# EAGLE design main (EAGLE 9.0.1)

## Sheet 1 of 2
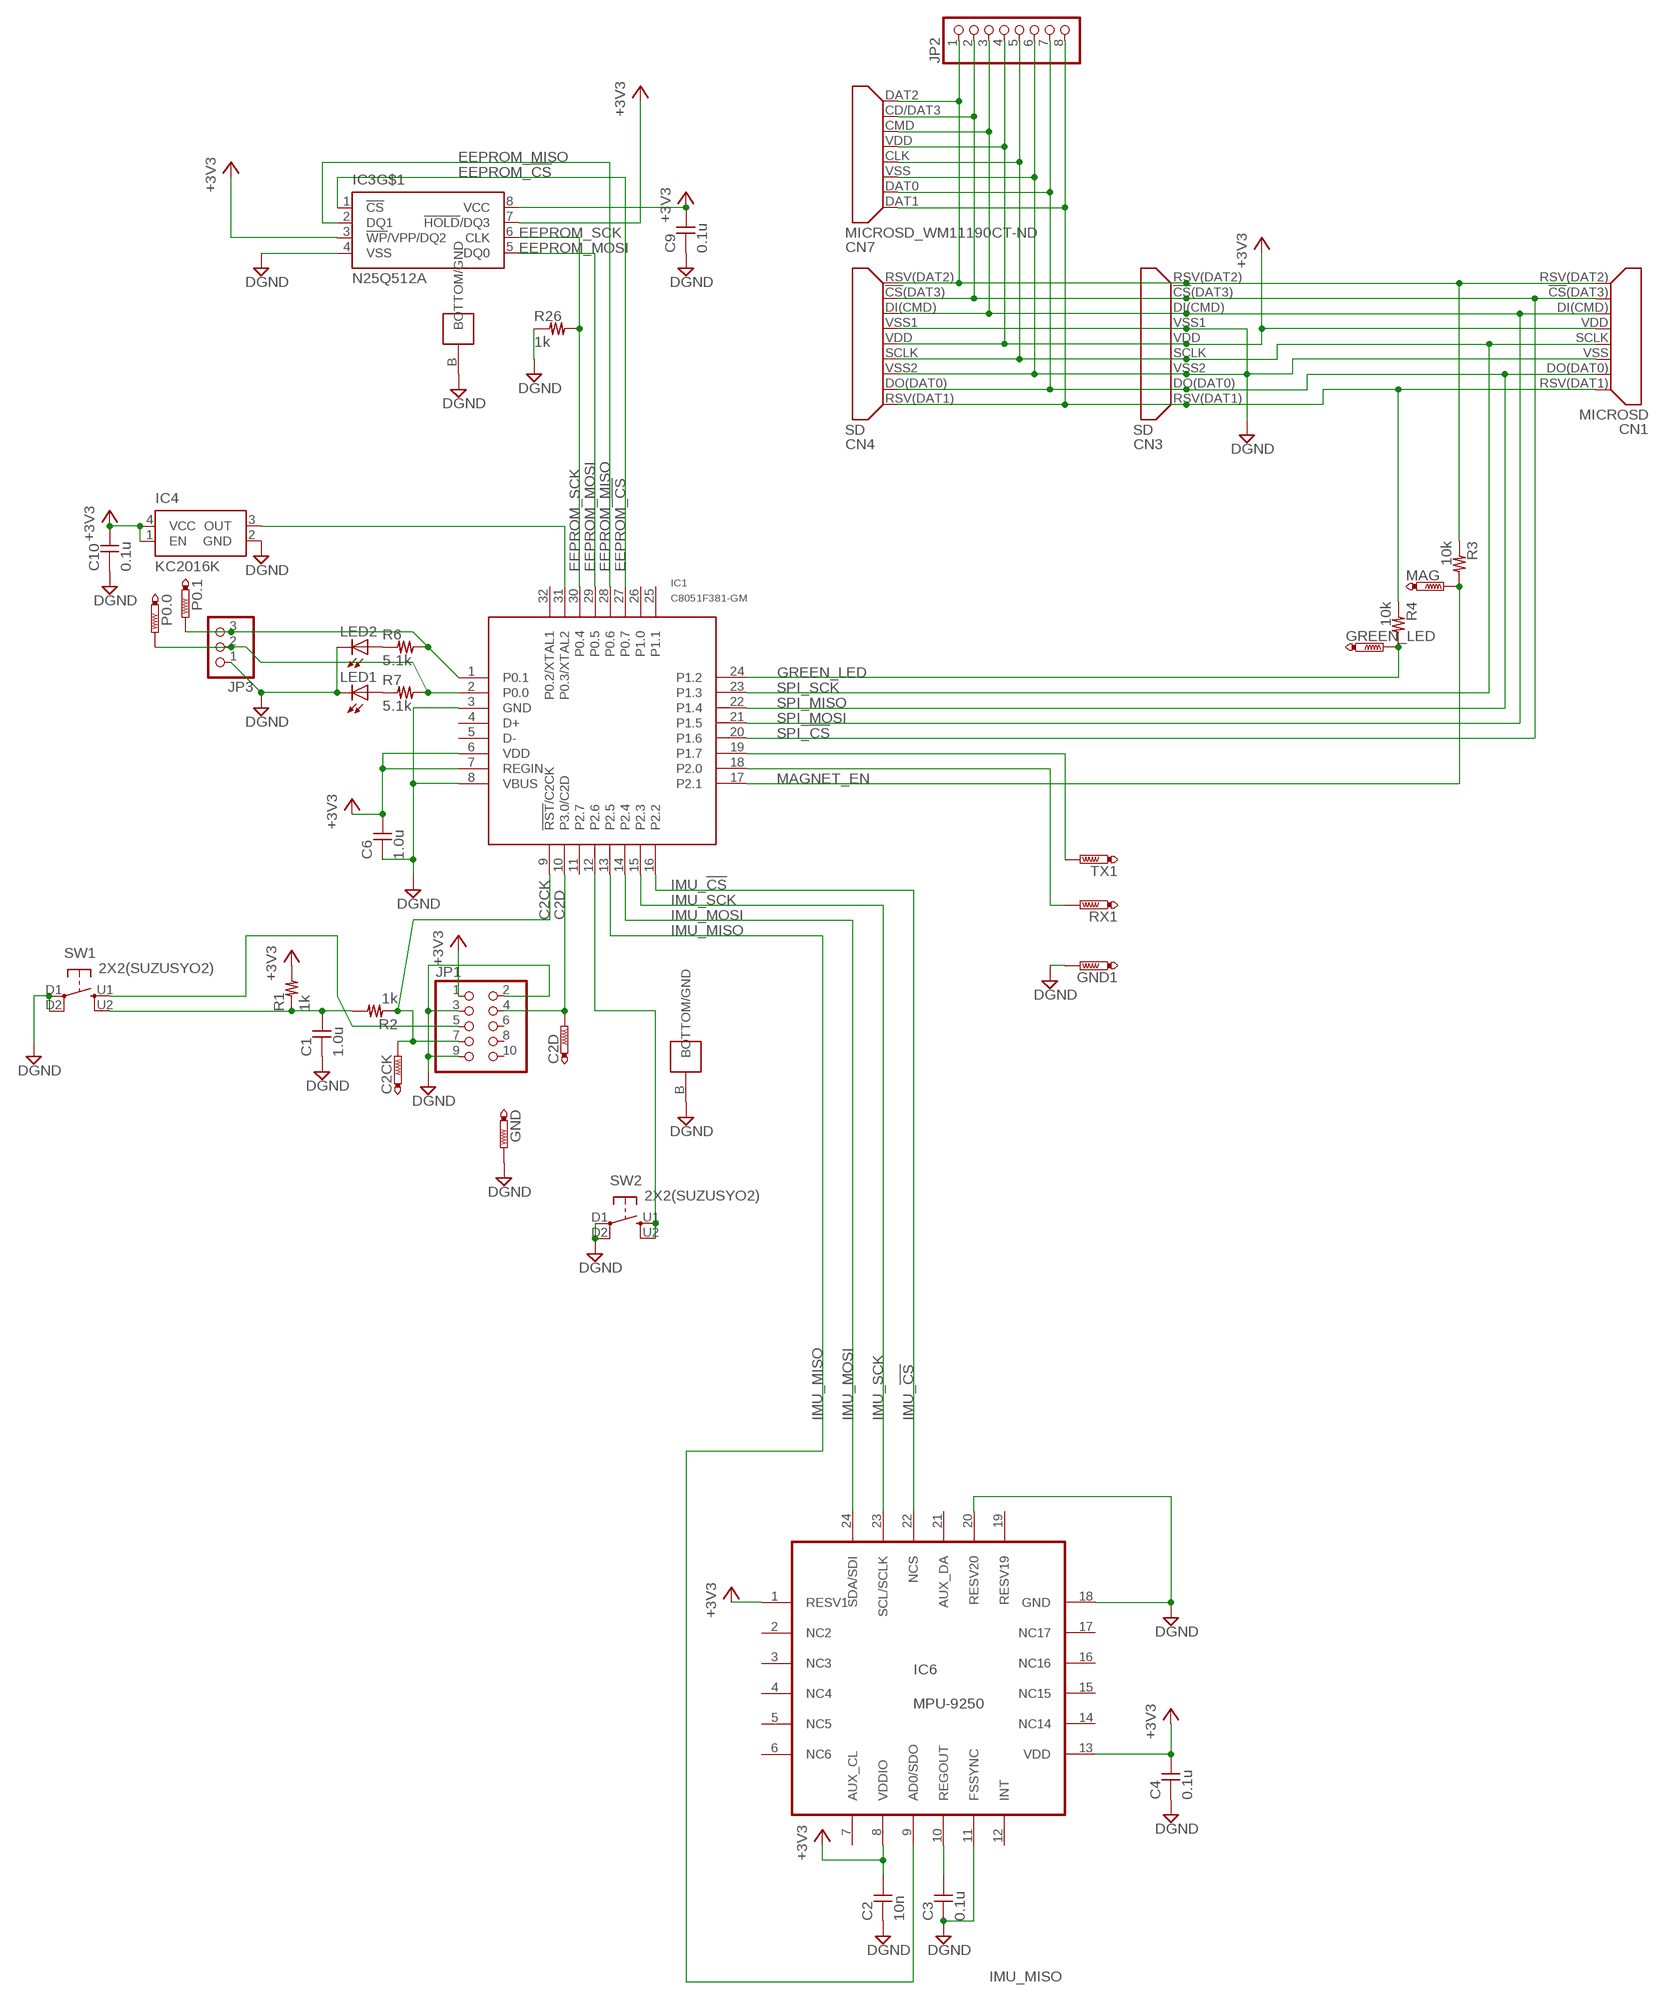
[diagram p0: schematic, sheet 1]

### Parts
C1  1.0u  C-1005  [1005]
C2  10n  C-1005  [1005]
C2CK  PTR1TP10R  [TP10R]
C2D  PTR1TP10R  [TP10R]
C3  0.1u  C-1005  [1005]
C4  0.1u  C-1005  [1005]
C6  1.0u  C-1005  [1005]
C9  0.1u  C-1005  [1005]
C10  0.1u  C-1005  [1005]
CN1  MICROSD  [MICROSD]
CN3  SD  [SD]
CN4  SD  [SD]
CN7  MICROSD_WM11190CT-ND  [5033981892]
GND  PTR1TP10R  [TP10R]
GND1  PTR1TP10R  [TP10R]
GREEN_LED  PTR1TP10R  [TP10R]
IC1  C8051F381-GM  [QFN32]
IC3  N25Q512A  [V-PDFN-8]
IC4  KC2016K  [KC2016K]
IC6  MPU-9250  [QFN-24]
JP1  PINHD-2X5  [2X05]
JP2  PINHD-1X8  [1X08]
JP3  PINHD-1X3  [1X03]
LED1  LED1608O  [1608-OLI]
LED2  LED1608O  [1608-OLI]
MAG  PTR1TP10R  [TP10R]
P0.0  PTR1TP10R  [TP10R]
P0.1  PTR1TP10R  [TP10R]
R1  1k  R-1005  [1005]
R2  1k  R-1005  [1005]
R3  10k  R-1005  [1005]
R4  10k  R-1005  [1005]
R6  5.1k  R-1005  [1005]
R7  5.1k  R-1005  [1005]
R26  1k  R-1005  [1005]
RX1  PTR1TP10R  [TP10R]
SW1  2X2(SUZUSYO2)  [2X2(SUZUSYO2)]
SW2  2X2(SUZUSYO2)  [2X2(SUZUSYO2)]
TX1  PTR1TP10R  [TP10R]

### Nets
+3V3: C2.P$2 C4.P$2 C6.P$2 C9.P$2 C10.P$2 CN1.VDD CN3.VDD CN4.VDD CN7.VDD IC1.6(VDD) IC1.7(REGIN) IC3.3(!WP!/VPP/DQ2) IC3.7(!HOLD!/DQ3) IC3.8(VCC) IC4.1(EN) IC4.4(VCC) IC6.1(RESV1) IC6.8(VDDIO) IC6.13(VDD) JP1.1 JP2.4 R1.P$2
C2CK: C2CK.TP IC1.9(!RST!/C2CK) JP1.7 R2.P$1
C2D: C2D.TP IC1.10(P3.0/C2D) JP1.4
DGND: C1.P$1 C2.P$1 C3.P$1 C4.P$1 C6.P$1 C9.P$1 C10.P$1 CN1.VSS CN3.VSS1 CN3.VSS2 CN4.VSS1 CN4.VSS2 CN7.VSS GND1.TP GND.TP IC1.3(GND) IC1.8(VBUS) IC1.B(BOTTOM/GND) IC3.4(VSS) IC3.B(BOTTOM/GND) IC4.2(GND) IC6.11(FSSYNC) IC6.18(GND) IC6.20(RESV20) JP1.2 JP1.3 JP1.9 JP2.6 JP3.1 LED1.K LED2.K R26.P$1 SW1.D1(P) SW1.D2(P1) SW2.D1(P) SW2.D2(P1) ; also sheet 2
EEPROM_!CS: IC1.27(P0.7) IC3.1(!CS)
EEPROM_MISO: IC1.28(P0.6) IC3.2(DQ1)
EEPROM_MOSI: IC1.29(P0.5) IC3.5(DQ0)
EEPROM_SCK: IC1.30(P0.4) IC3.6(CLK) R26.P$2
GREEN_LED: CN1.RSV(DAT1) CN3.RSV(DAT1) CN4.RSV(DAT1) CN7.DAT1 JP2.8 R4.P$1
IMU_!CS: IC1.16(P2.2) IC6.22(NCS)
IMU_MISO: IC1.13(P2.5) IC6.9(AD0/SDO)
IMU_MOSI: IC1.14(P2.4) IC6.24(SDA/SDI)
IMU_SCK: IC1.15(P2.3) IC6.23(SCL/SCLK)
MAGNET_EN: CN1.RSV(DAT2) CN3.RSV(DAT2) CN4.RSV(DAT2) CN7.DAT2 JP2.1 R3.P$1
N$1: IC1.19(P1.7) TX1.TP
N$2: IC1.18(P2.0) RX1.TP
N$3: JP1.5 SW1.U1(S)
N$4: IC1.1(P0.1) JP3.3 P0.1.TP R6.P$2
N$6: LED2.A R6.P$1
N$7: GREEN_LED.TP IC1.24(P1.2) R4.P$2
N$9: LED1.A R7.P$1
N$11: IC1.31(P0.3/XTAL2) IC4.3(OUT)
N$12: IC1.12(P2.6) SW2.U1(S) SW2.U2(S1)
N$13: C3.P$2 IC6.10(REGOUT)
N$14: IC1.17(P2.1) MAG.TP R3.P$2
N$15: IC1.2(P0.0) JP3.2 P0.0.TP R7.P$2
N$27: C1.P$2 R1.P$1 R2.P$2 SW1.U2(S1)
SPI_!CS: CN1.!CS!(DAT3) CN3.!CS!(DAT3) CN4.!CS!(DAT3) CN7.CD/DAT3 IC1.20(P1.6) JP2.2
SPI_MISO: CN1.DO(DAT0) CN3.DO(DAT0) CN4.DO(DAT0) CN7.DAT0 IC1.22(P1.4) JP2.7
SPI_MOSI: CN1.DI(CMD) CN3.DI(CMD) CN4.DI(CMD) CN7.CMD IC1.21(P1.5) JP2.3
SPI_SCK: CN1.SCLK CN3.SCLK CN4.SCLK CN7.CLK IC1.23(P1.3) JP2.5
Unconnected: IC1.4(D+) IC1.5(D-) IC1.11(P2.7) IC1.25(P1.1) IC1.26(P1.0) IC1.32(P0.2/XTAL1) IC6.2(NC2) IC6.3(NC3) IC6.4(NC4) IC6.5(NC5) IC6.6(NC6) IC6.7(AUX_CL) IC6.12(INT) IC6.14(NC14) IC6.15(NC15) IC6.16(NC16) IC6.17(NC17) IC6.19(RESV19) IC6.21(AUX_DA) JP1.6 JP1.8 JP1.10

## Sheet 2 of 2
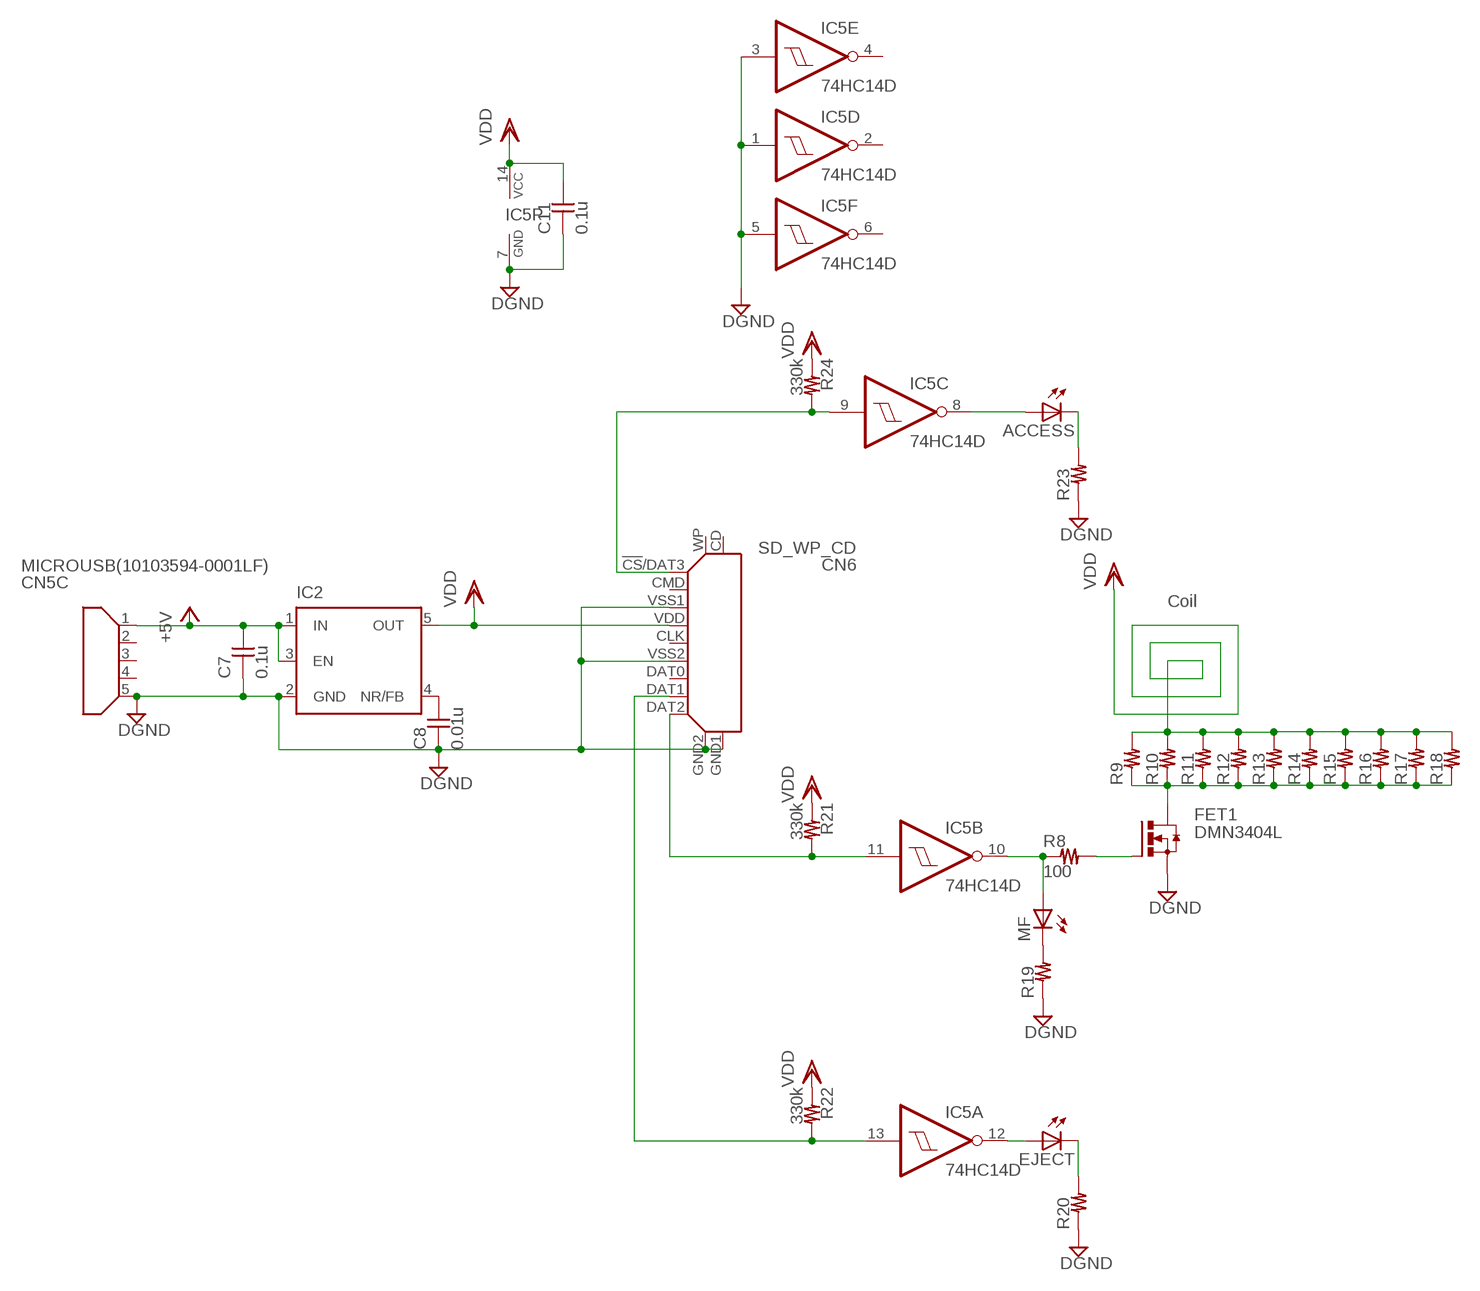
[diagram p1: schematic, sheet 2]

### Parts
ACCESS  LED2012  [2012]
C7  0.1u  C-1005  [1005]
C8  0.01u  C-1005  [1005]
C11  0.1u  C-1005  [1005]
CN5  MICROUSB(10103594-0001LF)  [MICROUSB(10103594-0001LF)]
CN6  SD_WP_CD  [10067847-001RLF]
EJECT  LED2012  [2012]
FET1  DMN3404L  [SOT23]
IC2  REGURATOR_SOT23  [SOT23]
IC5  74HC14D  [SO14]
MF  LED2012  [2012]
R8  100  R-1005  [1005]
R9  R-2012  [2012]
R10  R-2012  [2012]
R11  R-2012  [2012]
R12  R-2012  [2012]
R13  R-2012  [2012]
R14  R-2012  [2012]
R15  R-2012  [2012]
R16  R-2012  [2012]
R17  R-2012  [2012]
R18  R-2012  [2012]
R19  R-1005  [1005]
R20  R-1005  [1005]
R21  330k  R-1005  [1005]
R22  330k  R-1005  [1005]
R23  R-1005  [1005]
R24  330k  R-1005  [1005]

### Nets
+5V: C7.P$2 CN5.1 IC2.1(IN) IC2.3(EN)
DGND: C7.P$1 C8.P$1 C11.P$1 CN5.5 CN6.GND1 CN6.GND2 CN6.VSS1 CN6.VSS2 FET1.S IC2.2(GND) IC5.1(D:I) IC5.3(E:I) IC5.5(F:I) IC5.7(P:GND) R19.P$1 R20.P$1 R23.P$1 ; also sheet 1
N$8: EJECT.P$2(K) R20.P$2
N$10: C8.P$2 IC2.4(NR/FB)
N$17: IC5.10(B:O) MF.P$1(A) R8.P$1
N$18: CN6.DAT2 IC5.11(B:I) R21.P$2
N$19: EJECT.P$1(A) IC5.12(A:O)
N$20: CN6.DAT1 IC5.13(A:I) R22.P$2
N$21: FET1.G R8.P$2
N$22: FET1.D R9.P$1 R10.P$1 R11.P$1 R12.P$1 R13.P$1 R14.P$1 R15.P$1 R16.P$1 R17.P$1 R18.P$1
N$23: ACCESS.P$2(K) R23.P$2
N$24: MF.P$2(K) R19.P$2
N$25: ACCESS.P$1(A) IC5.8(C:O)
N$26: CN6.!CS!/DAT3 IC5.9(C:I) R24.P$2
VDD: C11.P$2 CN6.VDD IC2.5(OUT) IC5.14(P:VCC) R9.P$2 R10.P$2 R11.P$2 R12.P$2 R13.P$2 R14.P$2 R15.P$2 R16.P$2 R17.P$2 R18.P$2 R21.P$1 R22.P$1 R24.P$1
Unconnected: CN5.2 CN5.3 CN5.4 CN5.S1 CN5.S2 CN5.S3 CN5.S4 CN6.CD CN6.CLK CN6.CMD CN6.DAT0 CN6.WP IC5.2(D:O) IC5.4(E:O) IC5.6(F:O)

### Notes on the sheet
- Coil

## Library data of the parts
ACCESS EJECT LED1 LED2 MF = LED:LED
C1-C4 C6-C11 = reg,cap:C-
C2CK C2D GND GND1 GREEN_LED MAG P0.0 P0.1 RX1 TX1 = testpad:PTR1: TEST PIN
CN1 = Connector:MICROSD
CN3 CN4 = Connector:SD
CN5 = Connector:MICROUSB(10103594-0001LF)
CN6 = Connector:SD_WP_CD
CN7 = Connector:MICROSD_WM11190CT-ND
FET1 = MOSFET:DMN3404L
IC1 = C8051F34x:C8051F381-GM
IC2 = linear:REGURATOR_SOT23
IC3 = EEPROM:N25Q512A
IC4 = Oscillator:KC2016K
IC5 = 74xx:74*14: Hex schmitt trigger INVERTER
IC6 = GYRO:MPU-9250
JP1 = pinhead:PINHD-2X5: PIN HEADER
JP2 = pinhead:PINHD-1X8: PIN HEADER
JP3 = pinhead:PINHD-1X3: PIN HEADER
R1-R4 R6-R24 R26 = reg,cap:R-
SW1 SW2 = Switch:2X2(SUZUSYO2)

## Board
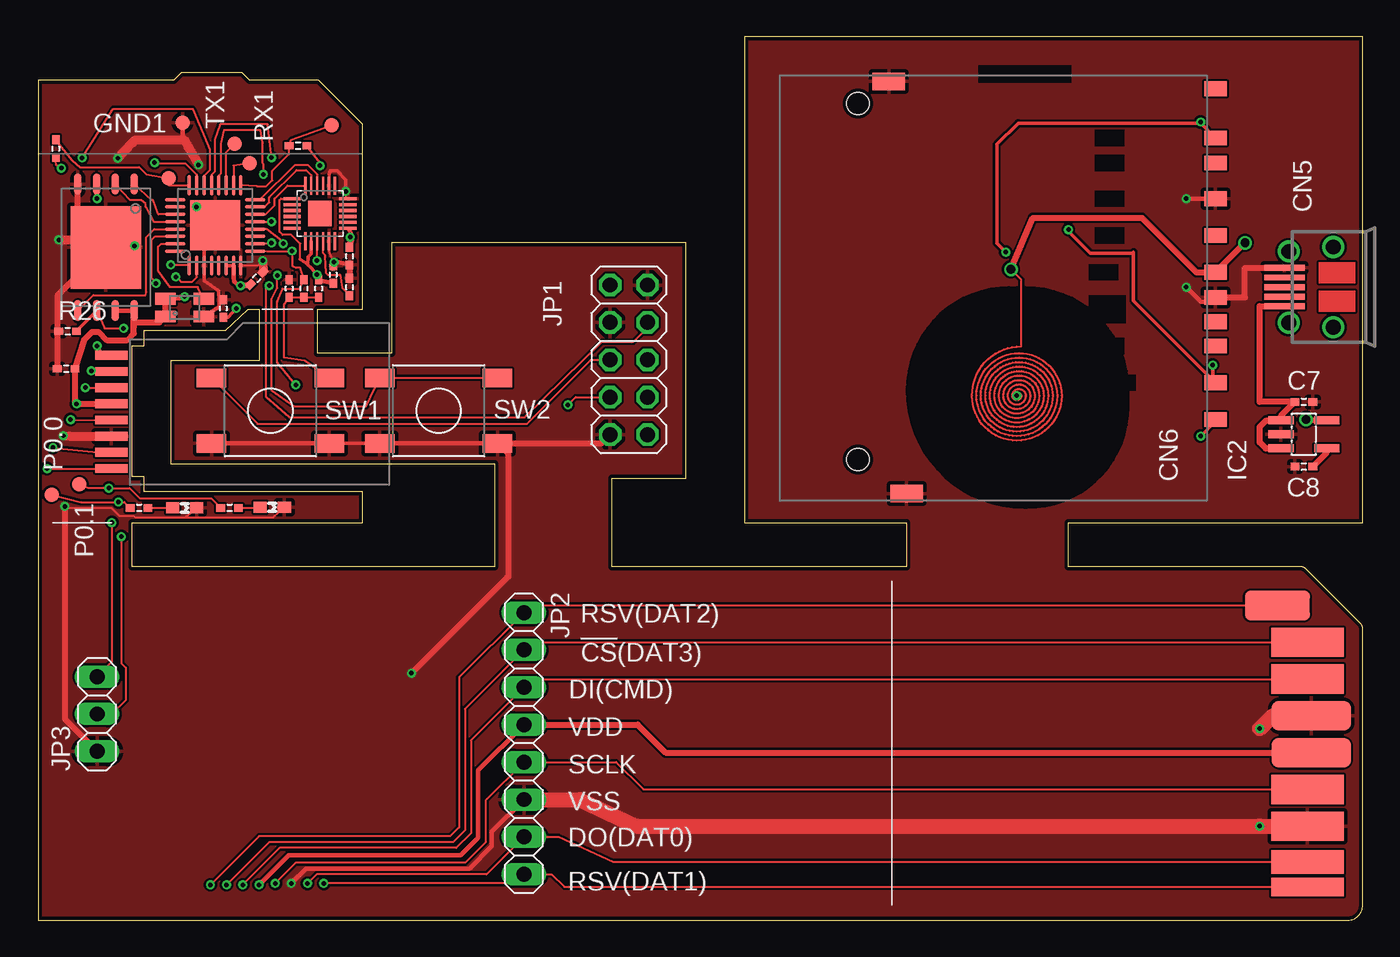
[diagram p2: board, top side]
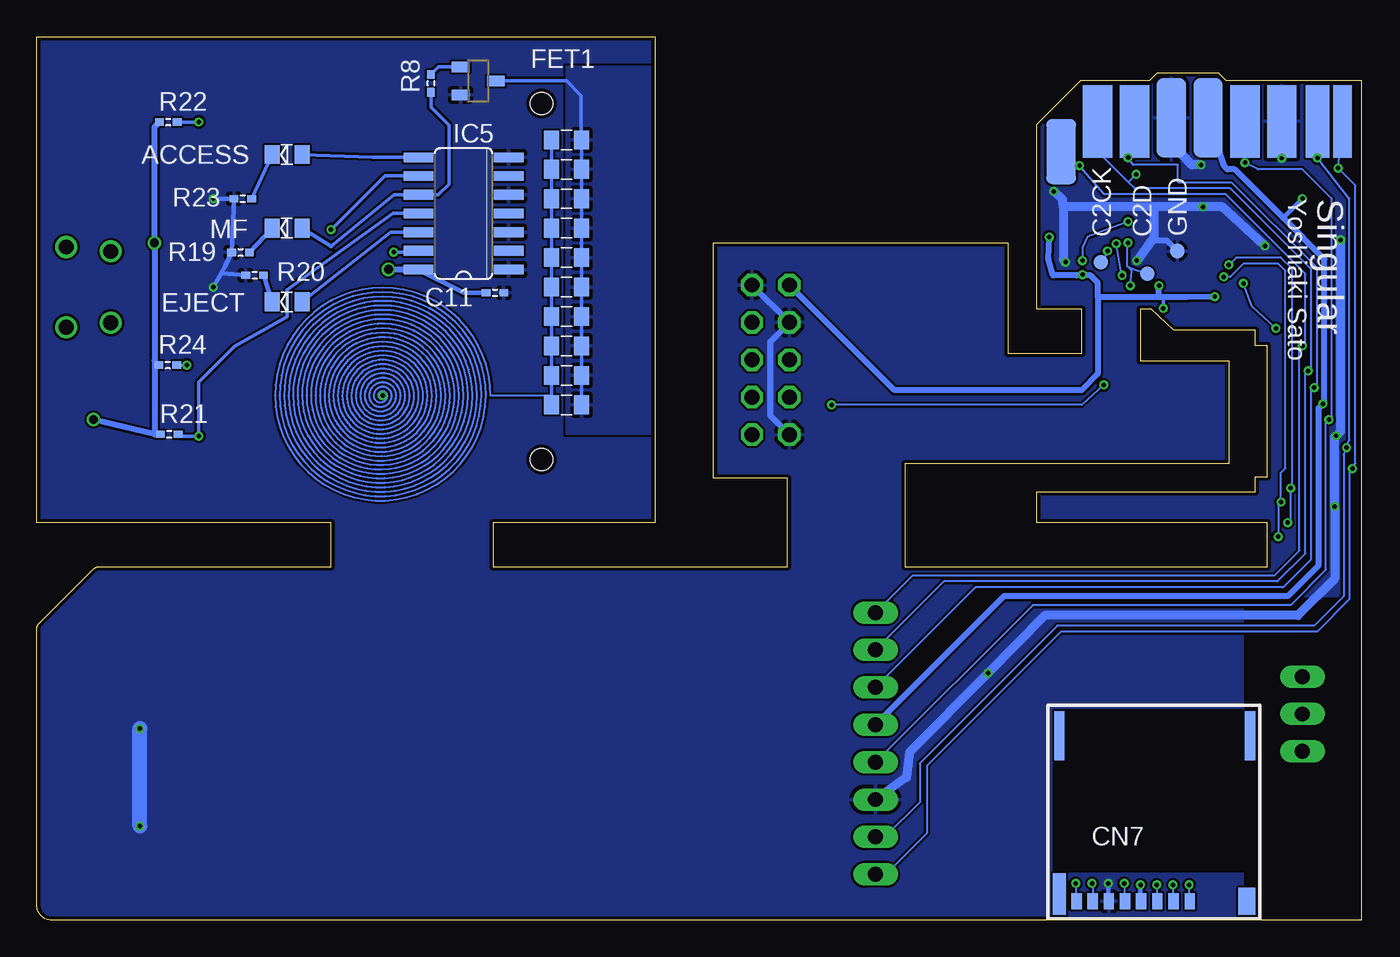
[diagram p3: board, bottom side, seen from below]

Size 90 x 60 mm. Coordinates in mm from the lower left corner, seen from the top.
Outline: 31,24 6.4,24 6.4,27 22.05,27 22.05,29.1 7.2,29.1 7.2,30.1 6.4,30.1 6.4,39 7.2,39 7.2,40.05 12.75,40.05 14.25,41.5 15,41.5 15,38 9,38 9,31 31,31 31,24
Outline: 39,24 39,30 44,30 44,46 24,46 24,38.5 19,38.5 19,41.5 22.05,41.5 22.05,54.05 19.05,57.05 14.35,57.05 13.85,57.55 9.7,57.55 9.2,57.05 0,57.05 0,0 89,0 arc90 90,1 90,19.79 arc45 89.85,20.15 86.15,23.85 arc45 85.79,24 70,24 70,27 90,27 90,60 48,60 48,27 59,27 59,24 39,24
Copper layers (1*16): Top 0.035mm / dielectric 1.5mm / Bottom 0.035mm
Design rules "Elecrow_2-layer_eagle_rule": minimum track width 6mil, minimum drill 12mil, track to track 6mil, track to pad 6mil, pad to pad 6mil, via to via 6mil, smd to smd 0mil, copper to edge 10mil, drill to drill 10mil, minimum pad ring 10mil, minimum via ring 6mil, stop-mask expansion 2mil, vias tented up to drill 100mil, thermal gap 10mil
tRestrict: 9 lines

### Footprints (pad centres in the part's own frame; a part is rotated, then mirrored left to right if it is on the bottom)
2012 = smd 1.02 x 1.27: P$1 -1.02,0; P$2 1.02,0
1005 = smd 0.6 x 0.5: P$1 -0.6,0; P$2 0.6,0
TP10R = smd 1 x 1: TP 0,0
MICROSD = smd 2.2 x 0.6: !CS!(DAT3) -1.27,-1.1; DI(CMD) -1.27,-2.2; DO(DAT0) -1.27,-6.6; RSV(DAT1) -1.27,-7.7; RSV(DAT2) -1.27,0; SCLK -1.27,-4.4; VDD -1.27,-3.3; VSS -1.27,-5.5
SD = smd 2 x 4.9: !CS!(DAT3) 2.5,2; DI(CMD) 5,2; SCLK 12.5,2; VSS2 15,2 | smd 1.6 x 4.9: DO(DAT0) 17.425,2 | smd 1.25 x 4.9: RSV(DAT1) 19.125,2 | smd 2 x 4.4: RSV(DAT2) 0,-0.05 | smd 2 x 5.4: VDD 10,2.25; VSS1 7.5,2.25
MICROUSB(10103594-0001LF) = smd 0.4 x 2.75: 1 -1.3,3.325; 2 -0.65,3.325; 3 0,3.325; 4 0.65,3.325; 5 1.3,3.325 | drill 1: S1 2.725,0; S2 2.425,3.03; S3 -2.425,3.03; S4 -2.725,0
10067847-001RLF = smd 1 x 1.5: !CS!/DAT3 -2.5,0; CD -6.65,0; CLK -12.5,0; CMD -5,0; DAT0 -17.425,0; DAT1 -19.125,0; DAT2 0,0; VDD -10,0; VSS1 -8.3,0; VSS2 -15,0; WP -22.475,0 | smd 1.2 x 2.2: GND1 5.025,-21; GND2 -22.975,-22.2 | hole 1.5: 2.725,-24.3; -21.475,-24.3
5033981892 = smd 0.7 x 1.1: CD/DAT3 5.55,12.93; CLK 8.85,12.93; CMD 6.65,12.93; DAT0 11.05,12.93; DAT1 12.15,12.93; DAT2 4.45,12.93; VDD 7.75,12.93; VSS 9.95,12.93 | smd 1.14 x 1.83: S1 0.57,12.915 | smd 0.7 x 3.33: S2 0.35,1.665; S3 13.31,1.665 | smd 0.86 x 2.8: S4 13.31,12.43
SOT23 = smd 0.711 x 1.2: D 0,1.2; G -0.95,-1.2; S 0.95,-1.2
QFN32 = smd 1.4 x 0.25: 1 -2.725,1.75; 2 -2.725,1.25; 3 -2.725,0.75; 4 -2.725,0.25; 5 -2.725,-0.25; 6 -2.725,-0.75; 7 -2.725,-1.25; 8 -2.725,-1.75; 17 2.725,-1.75; 18 2.725,-1.25; 19 2.725,-0.75; 20 2.725,-0.25; 21 2.725,0.25; 22 2.725,0.75; 23 2.725,1.25; 24 2.725,1.75 | smd 0.25 x 1.4: 9 -1.75,-2.725; 10 -1.25,-2.725; 11 -0.75,-2.725; 12 -0.25,-2.725; 13 0.25,-2.725; 14 0.75,-2.725; 15 1.25,-2.725; 16 1.75,-2.725; 25 1.75,2.725; 26 1.25,2.725; 27 0.75,2.725; 28 0.25,2.725; 29 -0.25,2.725; 30 -0.75,2.725; 31 -1.25,2.725; 32 -1.75,2.725 | smd 3.4 x 3.4: B 0,0
SOT23' = smd 0.55 x 1.7: 1 -0.95,-1.55; 2 0,-1.55; 3 0.95,-1.55; 4 0.95,1.55; 5 -0.95,1.55
V-PDFN-8 = smd 1.4 x 0.5: 1 -4.3,1.905; 2 -4.3,0.635; 3 -4.3,-0.635; 4 -4.3,-1.905; 5 4.3,-1.905; 6 4.3,-0.635; 7 4.3,0.635; 8 4.3,1.905 | smd 5.6 x 4.8: B 0,0
KC2016K = smd 1.4 x 0.8: 1 -1.3,-0.6; 2 1.3,-0.6; 3 1.3,0.6; 4 -1.3,0.6
SO14 = smd 0.66 x 2.032: 1 -3.81,-3.073; 2 -2.54,-3.073; 3 -1.27,-3.073; 4 0,-3.073; 5 1.27,-3.073; 6 2.54,-3.073; 7 3.81,-3.073; 8 3.81,3.073; 9 2.54,3.073; 10 1.27,3.073; 11 0,3.073; 12 -1.27,3.073; 13 -2.54,3.073; 14 -3.81,3.073
QFN-24 = smd 1.22 x 0.2: 1 -1.89,1; 2 -1.89,0.6; 3 -1.89,0.2; 4 -1.89,-0.2; 5 -1.89,-0.6; 6 -1.89,-1; 13 1.89,-1; 14 1.89,-0.6; 15 1.89,-0.2; 16 1.89,0.2; 17 1.89,0.6; 18 1.89,1 | smd 0.2 x 1.22: 7 -1,-1.89; 8 -0.6,-1.89; 9 -0.2,-1.89; 10 0.2,-1.89; 11 0.6,-1.89; 12 1,-1.89; 19 1,1.89; 20 0.6,1.89; 21 0.2,1.89; 22 -0.2,1.89; 23 -0.6,1.89; 24 -1,1.89 | smd 1.59 x 1.75: B 0,0
2X05 = drill 1.016 octagon: 1 -5.08,-1.27; 2 -5.08,1.27; 3 -2.54,-1.27; 4 -2.54,1.27; 5 0,-1.27; 6 0,1.27; 7 2.54,-1.27; 8 2.54,1.27; 9 5.08,-1.27; 10 5.08,1.27
1X08 = drill 1.016 long: 1 -8.89,0; 2 -6.35,0; 3 -3.81,0; 4 -1.27,0; 5 1.27,0; 6 3.81,0; 7 6.35,0; 8 8.89,0
1X03 = drill 1.016 long: 1 -2.54,0; 2 0,0; 3 2.54,0
1608-OLI = smd 0.89 x 0.76: A -0.825,0; K 0.825,0
2X2(SUZUSYO2) = smd 2 x 1.27: D1 -4,-2.225; D2 4,-2.225; U1 -4,2.225; U2 4,2.225

### Placement (x,y rotation side)
ACCESS  73,52 180 bottom
C1  17.05,42.9 270 top
C2  20.05,43.85 270 top
C2CK  17.7,44.7 0 bottom
C2D  14.55,43.9 0 bottom
C3  21.15,43 270 top
C4  21.15,45.1 90 top
C6  14.84,43.6 225 top
C7  86,35.2 180 top
C8  86,30.8 0 top
C9  1.9,37.45 0 top
C10  12.57,41.54 270 top
C11  58.87,42.61 180 bottom
CN1  6.24,38.37 0 top
CN3  20.4,52.25 0 bottom
CN4  84.25,21.38 270 top
CN5  88,43 90 top
CN6  80,34 270 top
CN7  7.2,14.2 180 bottom
EJECT  73,42 180 bottom
FET1  60,57 270 bottom
GND  12.5,45.45 0 bottom
GND1  9.8,54.15 0 top
GREEN_LED  8.85,50.4 0 top
IC1  12.02,47.19 90 top
IC2  [SOT23']  86,33 270 top
IC3  4.6,45.7 270 top
IC4  9.95,41.6 0 top
IC5  61,48 90 bottom
IC6  19.15,48 0 top
JP1  40.13,38.06 270 top
JP2  33,12 270 top
JP3  4,14 90 top
LED1  9.95,28 0 top
LED2  15.9,28.05 0 top
MAG  19.95,54 0 top
MF  73,47 180 bottom
P0.0  0.9,28.9 0 top
P0.1  2.8,29.6 0 top
R1  19.05,42.9 90 top
R2  18.05,42.9 270 top
R3  17.65,52.6 180 top
R4  1.2,52.4 90 top
R6  13,28 180 top
R7  6.85,28 180 top
R8  63.21,56.84 90 bottom
R9  54,35 180 bottom
R10  54,37 180 bottom
R11  54,39 180 bottom
R12  54,41 180 bottom
R13  54,43 180 bottom
R14  54,45 180 bottom
R15  54,47 180 bottom
R16  54,49 180 bottom
R17  54,51 180 bottom
R18  54,53 180 bottom
R19  76.15,45.35 0 bottom
R20  75.2,43.8 0 bottom
R21  81,33 0 bottom
R22  81.07,54.21 0 bottom
R23  76,49 0 bottom
R24  81.1,37.7 0 bottom
R26  2,40 0 top
RX1  14.35,51.4 0 top
SW1  15.77,34.6 0 top
SW2  27.2,34.6 0 top
TX1  13.35,52.75 0 top

### Tracks (layer width: path | path; a pad name or v marks a point on that pad's centre or on a via)
+3V3  (via drill 0.3)
  Top 0.152: IC6.1 16.5,49 16.4,48.9 16.4,46.75 16.6,46.55 17.2,46.55 17.8,45.95 17.8,44.9
  Top 0.254: IC1.7 IC1.6 | IC6.13 21.25,46.64 v21.2,46.4 | R1.P$2 v18.95,43.85 18.55,44.3 18.3,44.5 18.3,44.55 | C10.P$2 12.89,40.94 v13.45,41.55 | IC6.8 18.55,45.25 18.35,45.05 18.3,44.55 | 18.3,44.55 17.8,44.9
  Top 0.305: v15,2.4 17,4.4 28.7,4.4 29.9,5.6 29.9,10.17 JP2.4 | v13.75,43.1 13.6,43.15 13.3,43.35 13.27,43.63 IC1.7 | C4.P$2 21.15,46.05 v21.2,46.4 | 19.05,43.9 v18.95,43.85 19.1,43.7 19.1,43.45 C2.P$2 | IC3.8 IC3.7 | IC3.3 3.96,49.03 v4,49
  Top 0.406: CN1.VDD v2.6,35.07 2.5,35.17 C9.P$2 3.15,39.45 3.65,39.95 4.1,39.95 4.65,39.4 6.05,39.4 6.5,39.85 6.5,40.3 | JP2.4 40.73,13.27 42.62,11.38 CN4.VDD | 6.5,40.3 IC3.8 | 6.5,40.3 6.6,40.6 8.25,40.6 IC4.1 IC4.4 v9.95,42.35 | v13.75,43.1 C6.P$2 | v21.2,46.4 21.25,46.1
  Bottom 0.254: 13.45,42.31 v13.45,41.55
  Bottom 0.305: CN7.VDD 15,1.32 v15,2.4 | 5.3,47.7 v4,49
  Bottom 0.406: JP2.4 24.27,22 5,22 2.9,24.1 2.9,34.77 v2.6,35.07 2.5,35.17 2.5,44.9 5.3,47.7 8.6,51 9.1,51 9.3,51.2 CN3.VDD | v9.95,42.35 11.83,42.31 13.45,42.31 14,42.31 | 17.9,42.31 17.9,43.3 18.4,43.8 19.35,43.8 | 14,42.31 17.9,42.31 | v13.75,43.1 13.75,42.46 14,42.31 | v21.2,46.4 21.25,44.9 20.95,43.8 19.35,43.8 | 19.35,43.8 v18.95,43.85 | JP1.1 31.72,36 19,36 17.9,37.1 17.9,42.31
+5V
  Top 0.406: CN5.1 83,41.7 83,35.2 C7.P$2 84.45,34.25 IC2.1 83.45,33.95 83,33.5 83,32.45 83.4,32.05 IC2.3
C2CK  (via drill 0.3)
  Top 0.152: IC1.9 15.55,45.4 17.11,45.39 17.25,45.25 | 17.25,45.25 17.3,45.2 17.3,44.4 17.5,44.3 17.8,44.3 18.05,43.6 R2.P$1 17.75,42.9 16.6,42.9 16.25,42 16.25,37.9 v17.5,36.35 | 17.25,45.25 v17.25,45.45 | JP1.7 36.52,35.52 v36,35
  Bottom 0.152: v17.25,45.45 17.3,45.25 C2CK.TP | v36,35 19,35 v17.5,36.35
C2D  (via drill 0.3)
  Top 0.152: IC1.10 14.76,45.95 15.7,45.95 15.8,46.05 v15.85,46 | v15.7,43.1 15.5,43 15.5,35.5 17.05,34.15 33.05,34.15 38.3,39.3 40.45,39.3 41.4,40.25 JP1.4
  Bottom 0.152: v15.85,46 15.9,46 15.9,44.4 | C2D.TP 15.45,44.2 15.9,44.4 | v15.7,43.1 15.6,44.1 15.9,44.4
DGND  (via drill 0.3)
  Top 0.152: IC1.B 12.09,46.1 12.1,46.1 | LED2.K 15.97,27.35 9.97,27.35 | 9.97,27.35 LED1.K | 9.97,27.35 6.6,27.35 6.5,27.45 5.5,27.45 4.95,28 1.9,28 v1.8,28.1 | 19.75,50.65 IC6.20 | 20.05,44.75 19.75,45.45 IC6.11 | IC6.18 20.9,49.01 v20.9,49.5 | IC1.8 14.91,44.47 v15.25,44.8
  Top 0.254: IC1.B 11.27,45.44 IC1.3 11.27,43.42 12.25,42.75 12.3,42 | 12.3,42 12.3,41.65 IC4.2 | 19.75,50.65 19.85,50.9 20.3,50.9 20.9,50.3 v20.9,49.5 | v20.1,44.7 20.05,44.75 | C10.P$1 12.44,42.14 12.3,42 | SW2.D1 SW1.D2
  Top 0.305: v17.2,2.5 18.2,3.5 29.3,3.5 30.8,5 30.8,5.99 JP2.6 | SW1.D2 SW1.D1 | SW2.D1 SW2.D2 31.95,31.62 | C4.P$1 20.45,44.7 v20.1,44.7 C2.P$1 | 31.89,23.3 31.95,23.3 | GND1.TP 9.8,52.9 10.18,52.52 | v78,49 CN6.VSS2 | v78,43 79,42 79.7,42 CN6.VSS1
  Top 0.406: IC3.4 2.69,46.5 3,46.2 | C9.P$1 1.3,42.4 IC3.B | C4.P$1 C3.P$1 | 31.95,23.3 31.95,31.62 | v25.37,16.78 31.89,23.3 | JP3.1 1.8,13.66 v1.8,28.1 | SW2.D2 38.26,32.38 JP1.9 | CN5.5 82,44.3 82,42.3 CN6.VSS1
  Top 0.61: CN1.VSS 2.13,32.87 v1.7,32.9 | v5.4,51.75 6.4,52.8 6.6,53 9.9,53 10.18,52.52 v10.9,51.3 | v1.4,46.2 3,46.2 3.6,46.2 IC3.B 5.95,45.2 v6.55,45.8 | IC1.B 11.28,46.45 v10.75,48.45 | v15.25,44.8 C6.P$1
  Top 1.016: CN4.VSS2 v83,6.38 40.62,6.38 36.81,8.19 JP2.6 | CN4.VSS1 83.88,13.88 v83,13
  Bottom 0.152: 17.2,1.32 CN7.VSS
  Bottom 0.305: v17.2,2.5 17.2,1.32 | v78,49 R23.P$1 R19.P$1 77.2,44.4 v78,43 77.45,43.95 R20.P$1
  Bottom 0.406: GND.TP 13.21,46.16 14.23,46.16 | JP1.9 40.15,34.27 40.15,39.3 JP1.3 JP1.2
  Bottom 0.61: v5.4,51.75 CN3.VSS2 | v1.4,46.2 1.4,33.2 v1.7,32.9 1.8,32.8 v1.8,28.1 1.8,23.2 4.3,20.7 21.49,20.7 v25.37,16.78 30.7,11.4 30.9,9.7 JP2.6 | v10.9,51.3 11.5,51.3 12.15,52 CN3.VSS1 | v6.55,45.8 9.45,48.45 v10.75,48.45 14.1,48.45 | v20.9,49.5 20.3,48.95 20.25,48.45 | 20.25,48.45 20.25,44.9 v20.1,44.7 | 14.1,48.45 20.25,48.45 | 14.1,48.45 14.1,46.35 14.23,46.16 15.2,44.8 v15.25,44.8
  Bottom 1.016: v83,6.38 v83,13
  pour Top: -1,61 91,61 91,-1 -1,-1
  pour Bottom (rank 2): -1,62 92,62 92,-1 8,-1 8,22 -1,22
EEPROM_!CS
  Top 0.152: IC3.1 7.7,48.91 7.8,48.9 8.16,47.94 IC1.27
EEPROM_MISO
  Top 0.152: IC3.2 6.24,48.9 7,48.9 7.3,48.65 7.3,48.45 7.86,47.44 IC1.28
EEPROM_MOSI
  Top 0.152: IC3.5 3.75,42.45 7.3,42.45 7.35,42.65 7.35,46.4 7.89,46.94 IC1.29
EEPROM_SCK  (via drill 0.3)
  Top 0.152: IC3.6 4.51,40.2 v5.8,40.2 | v8,43.25 7.7,43.6 7.7,46.2 7.94,46.44 IC1.30
  Top 0.254: R26.P$2 2.6,40.03 IC3.6
  Bottom 0.152: v5.8,40.2 7.45,41.7 v8,43.25
GREEN_LED  (via drill 0.3)
  Top 0.152: v0.6,30.67 CN1.RSV(DAT1) | CN4.RSV(DAT1) 35.75,2.25 34.89,3.11 JP2.8 32.39,2.5 v19.4,2.5 | v1.57,51.08 1.23,51.27 1.2,51.6 R4.P$1
  Bottom 0.152: CN3.RSV(DAT1) v1.57,51.08 0.4,49.9 0.4,31 v0.6,30.67 0.8,30.47 0.8,21.8 3,19.6 20.4,19.6 29.5,10.5 29.5,5.9 32.29,3.11 JP2.8 | CN7.DAT1 19.4,1.32 v19.4,2.5
IMU_!CS
  Top 0.152: IC1.16 15.04,48.95 17.45,51.3 18.3,51.3 18.95,50.65 IC6.22
IMU_MISO  (via drill 0.3)
  Top 0.152: v18.95,44.8 IC6.9 | IC1.13 v15.85,47.44 v15.85,47.45
  Bottom 0.152: v18.95,44.8 18.95,45.66 18.61,46.41 v15.85,47.45
IMU_MOSI
  Top 0.152: IC1.14 15.44,47.94 16.05,48.55 16.05,49 16.94,49.89 IC6.24
IMU_SCK
  Top 0.152: IC1.15 15.39,48.44 15.7,48.75 15.7,49.1 17.55,50.95 18.2,50.95 18.55,50.6 IC6.23
MAGNET_EN  (via drill 0.3)
  Top 0.152: CN4.RSV(DAT2) 33.48,21.38 JP2.1 28.6,16.49 28.6,6.3 28,5.7 15,5.7 v11.7,2.4 | v4,39 4.43,38.37 CN1.RSV(DAT2) | R3.P$1 19.15,51.45 v19.15,51.25
  Bottom 0.152: JP2.1 30.49,23.4 5.9,23.4 4.2,25.1 4.2,38.8 v4,39 3.8,39.2 3.8,43.9 9.2,49.3 17.45,49.3 v19.15,51.25 CN3.RSV(DAT2) | CN7.DAT2 11.7,1.32 v11.7,2.4
N$1
  Top 0.152: IC1.19 12.77,52.17 TX1.TP
N$2
  Top 0.152: IC1.18 13.27,51.25 RX1.TP
N$3
  Top 0.152: JP1.5 37.56,38.06 33.2,33.7 14.89,33.7 SW1.U1
N$4  (via drill 0.3)
  Top 0.152: R6.P$2 11.75,28.65 6.9,28.65 6.2,29.35 v4.8,29.35 3.4,29.35 P0.1.TP | v9,44.5 10.23,44.5 IC1.1 | JP3.3 5,17.54 v5,27
  Bottom 0.152: v9,44.5 8.5,45 5.45,45 4.7,44.25 4.7,29.45 v4.8,29.35 4.8,27.2 v5,27
N$6
  Top 0.152: LED2.A 15.03,28 R6.P$1
N$7
  Top 0.152: R4.P$2 2.3,51.6 2.85,51.15 6.85,51.15 7.35,50.65 GREEN_LED.TP 8.88,49.91 IC1.24
N$8
  Bottom 0.305: EJECT.P$2 R20.P$2
N$9
  Top 0.152: R7.P$1 LED1.A
N$10
  Top 0.406: IC2.4 87.55,31.75 C8.P$2
N$11
  Top 0.152: IC1.31 8.34,45.94 8.15,45.75 8.15,44.1 8.95,43 10.85,43 11.05,42.55 IC4.3
N$12  (via drill 0.3)
  Top 0.152: SW2.U2 SW2.U1 22.27,34.9 17.4,34.9 15.85,36 15.85,42.2 16.25,42.95 v16.25,43.8 | IC1.12 15.51,46.94 16.1,46.5 16.55,46.15 v16.65,45.95
  Bottom 0.152: v16.65,45.95 16.35,44.1 16.35,44 v16.25,43.8
N$13
  Top 0.152: IC6.10 19.35,45.3 19.5,45.15 19.5,45.05 19.55,44 19.55,43.95 19.65,43.85 20.5,43.85 20.65,42.95 C3.P$2
N$14
  Top 0.152: MAG.TP 17.2,53 R3.P$2 17.05,52.05 15.9,50.9 15.9,50.25 15.5,49.85 14.85,49.85 IC1.17
N$15  (via drill 0.3)
  Top 0.152: P0.0.TP 2.9,28.4 v5.45,28.4 5.85,28.4 R7.P$2 | v9.35,43.7 9.7,43.35 10.45,43.35 10.77,43.67 IC1.2 | JP3.2 5,14 5.95,14.95 5.95,17.15 5.65,17.45 v5.65,26.05
  Bottom 0.152: v9.35,43.7 8.9,43.7 8,44.6 5.65,44.6 5.15,44.1 5.15,30.7 5.45,30.4 v5.45,28.4 5.65,28.2 v5.65,26.05
N$17
  Bottom 0.254: 70.01,45.77 65.71,49.27 IC5.10 62.73,49.27 62,50 62,54 63.21,55.21 R8.P$1
  Bottom 0.305: 70.01,45.77 MF.P$1
N$18  (via drill 0.3)
  Top 0.254: CN6.DAT2 80,33.89 v78.99,32.88
  Bottom 0.254: R21.P$2 80.28,32.88 v78.99,32.88 78.99,36.53 76.55,38.97 72.98,40.97 72.98,42.8 65.78,48 IC5.11
N$19
  Bottom 0.254: EJECT.P$1 65.95,46.73 IC5.12
N$20  (via drill 0.3)
  Top 0.254: 78.99,54.13 v78.99,54.21 | 78.99,54.13 CN6.DAT1 | 78.99,54.13 66.59,54.13 65.14,52.69 65.14,45.98 v65.75,45.37
  Bottom 0.254: R22.P$2 v79,54.21 v78.99,54.21 | v65.75,45.37 64.16,45.37 IC5.13
N$21
  Bottom 0.254: FET1.G 62.7,57.95 R8.P$2
N$22
  Bottom 0.254: R9.P$1 R10.P$1 R11.P$1 R12.P$1 R13.P$1 R14.P$1 R15.P$1 R16.P$1 R17.P$1 R18.P$1 53,53.02 53,56 54,57 FET1.D
  pour Bottom: 47,33 54,33 54,58 47,58
N$23
  Bottom 0.254: R23.P$2 ACCESS.P$2
N$24
  Bottom 0.305: R19.P$2 MF.P$2
N$25
  Bottom 0.254: ACCESS.P$1 67.17,51.81 IC5.8
N$26  (via drill 0.3)
  Top 0.254: v79.8,37.7 79.8,36.7 CN6.!CS!/DAT3 74.42,42.08 74.42,45.37 74.35,45.3 71.5,45.3 70,46.8 v70,46.9
  Bottom 0.254: IC5.9 64.09,50.55 66.34,50.55 v70,46.9 | v79.8,37.7 R24.P$2
N$27
  Top 0.152: R1.P$1 R2.P$2 C1.P$2 16.7,41.8 16.7,38.2 18.09,38 SW1.U2
SPI_!CS  (via drill 0.3)
  Top 0.152: CN4.!CS!(DAT3) 33.52,18.88 JP2.2 29,14.35 29,6.1 28.2,5.3 15.7,5.3 v12.8,2.4 | v3.6,37.3 3.83,37.27 CN1.!CS!(DAT3) | IC1.20 12.3,49.95 12.3,50.6 12.4,50.7 12.4,52.75 12.6,53.65 15.1,53.65 15.25,52.8 15.25,51.4 15.3,51.35 v15.3,50.65
  Bottom 0.152: JP2.2 28.35,23 5.7,23 3.8,24.9 3.8,37.1 v3.6,37.3 3.4,37.5 3.4,44.2 8.9,49.7 15.4,49.7 15.82,50.12 | CN7.CD/DAT3 12.8,1.32 v12.8,2.4 | CN3.!CS!(DAT3) 17.9,52.2 15.82,50.12 | 15.82,50.12 v15.3,50.65
SPI_MISO  (via drill 0.3)
  Top 0.152: v1,32.1 4.03,31.77 CN1.DO(DAT0) | CN4.DO(DAT0) 39.05,3.95 35.35,5.65 JP2.7 30.45,3.1 18.9,3.1 v18.3,2.5 | IC1.22 11.27,50.57 11.65,50.95 11.65,52.35 10.5,55.1 5.1,55.1 v2.98,51.77
  Bottom 0.152: CN3.DO(DAT0) v2.98,51.77 0.8,49 0.8,32.6 1,32.3 v1,32.1 1.2,31.6 1.2,22 3.2,20 20.65,20 30,10.65 30,8 32.35,5.65 JP2.7 | CN7.DAT0 18.25,2.45 v18.3,2.5
SPI_MOSI  (via drill 0.3)
  Top 0.152: CN4.DI(CMD) 33.56,16.38 JP2.3 29.4,12.21 29.4,5.9 28.4,4.9 16.4,4.9 v13.9,2.4 | v3.2,36.17 CN1.DI(CMD) | 11.77,50.37 IC1.21 11.77,50.62 12,50.85 12,53 12.35,54.05 15.6,54.05 v15.85,51.8
  Bottom 0.152: JP2.3 26.21,22.6 5.3,22.6 3.4,24.5 3.4,35.97 v3.2,36.17 3,36.37 3,44.3 8.8,50.1 12.4,50.1 12.45,50.15 12.45,51.3 15.5,51.3 v15.85,51.8 CN3.DI(CMD) | CN7.CMD 13.9,1.32 v13.9,2.4
SPI_SCK  (via drill 0.3)
  Top 0.152: v2.2,34 CN1.SCLK | CN4.SCLK 41.12,8.88 39.27,10.73 JP2.5 30.4,8.13 30.4,5.3 29,3.9 17.5,3.9 v16.1,2.5 | v7.9,51.45 8.1,51.4 10,51.4 10.77,50.63 IC1.23
  Bottom 0.152: CN3.SCLK v7.9,51.45 7,51 4,51 2,49 2,34.2 v2.2,34 2.4,33.8 2.4,23.8 4.8,21.4 22.33,21.4 JP2.5 | CN7.CLK 16.1,1.32 v16.1,2.5
VDD  (via drill 0.3, 0.6)
  Top 0.152: v66.49,35.62 arc-180 66.8,35.62 arc-180 66.19,35.62 arc-180 67.1,35.62 arc-180 65.89,35.62 arc-180 67.41,35.62 arc-180 65.58,35.62 arc-180 67.71,35.62 arc-180 65.28,35.62 arc-180 68.02,35.62 arc-180 64.97,35.62 arc-180 68.32,35.62 arc-180 64.67,35.62 arc-180 68.63,35.62 arc-180 64.36,35.62 arc-180 68.93,35.62 arc-180 64.06,35.62 arc-180 69.24,35.62 arc-180 63.75,35.62 arc-180 69.54,35.62 arc-180 63.45,35.62 arc-90 66.8,38.97 66.8,43.5 v66.1,44.2
  Top 0.406: IC2.5 87.25,33.95 v86.14,34 | v82,46 CN6.VDD 78.7,44 75,47.7 67.6,47.7 v66.1,44.2
  Bottom 0.152: v66.49,35.62 arc180 66.8,35.62 arc180 66.19,35.62 arc180 67.1,35.62 arc180 65.89,35.62 arc180 67.41,35.62 arc180 65.58,35.62 arc180 67.71,35.62 arc180 65.28,35.62 arc180 68.02,35.62 arc180 64.97,35.62 arc180 68.32,35.62 arc180 64.67,35.62 arc180 68.63,35.62 arc180 64.36,35.62 arc180 68.93,35.62 arc180 64.06,35.62 arc180 69.24,35.62 arc180 63.75,35.62 arc180 69.54,35.62 arc180 63.45,35.62 arc180 69.85,35.62 arc180 63.14,35.62 arc180 70.15,35.62 arc180 62.84,35.62 arc180 70.46,35.62 arc184 62.53,35.31 arc175 70.76,35.62 arc180 62.23,35.62 arc180 71.07,35.62 arc180 61.92,35.62 arc180 71.37,35.62 arc184 61.62,35.31 arc176 71.68,35.62 arc181 61.31,35.62 arc179 71.98,35.62 arc181 61.01,35.62 arc179 72.29,35.62 arc181 60.7,35.62 arc179 72.59,35.62 arc181 60.4,35.62 arc179 72.89,35.62 arc181 60.09,35.62 arc179 73.2,35.62 arc181 59.79,35.62 arc179 73.5,35.62 arc181 59.48,35.62 arc179 73.81,35.62 arc181 59.18,35.62 55.02,35.62
  Bottom 0.254: R9.P$2 55.02,35.62 R10.P$2 R11.P$2 R12.P$2 R13.P$2 R14.P$2 R15.P$2 R16.P$2 R17.P$2 R18.P$2 | 82,38 R24.P$1
  Bottom 0.305: C11.P$2 60.97,42.61 IC5.14
  Bottom 0.406: 82,33 v86.14,34 | 82,33 82,38 v82,46 82,53.87 R22.P$1 | v66.1,44.2 64.08,44.2 IC5.14 | 82,33 R21.P$1

### Text on the board
tNames: RSV(DAT2) | !CS!(DAT3) | DI(CMD) | VDD | SCLK | VSS | DO(DAT0) | RSV(DAT1)
bNames: Singular | Yoshiaki Sato